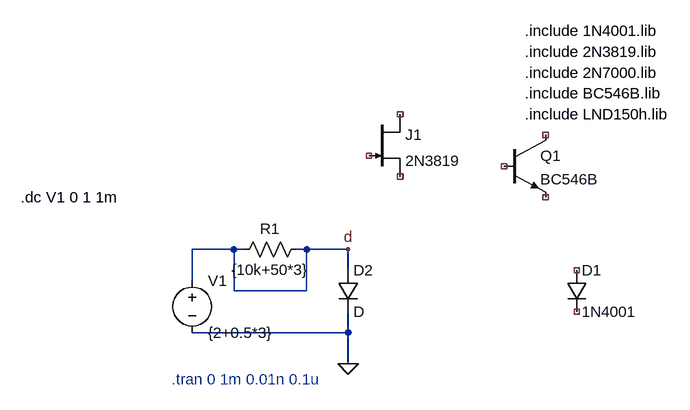
[diagram p0: schematic TP_FE diodo.asc]
TP_FE diodo.asc, the LTspice schematic file:
Version 4.1
SHEET 1 880 680
WIRE -144 432 -208 432
WIRE -128 432 -144 432
WIRE -32 432 -48 432
WIRE 32 432 -32 432
WIRE 32 464 32 432
WIRE -208 480 -208 432
WIRE -144 496 -144 432
WIRE -32 496 -32 432
WIRE -32 496 -144 496
WIRE 32 560 32 528
WIRE 32 560 -208 560
WIRE 32 608 32 560
FLAG 32 608 0
FLAG 32 432 d
SYMBOL diode 368 464 R0
SYMATTR InstName D1
SYMATTR Value 1N4001
SYMBOL njf 64 224 R0
SYMATTR InstName J1
SYMATTR Value 2N3819
SYMBOL npn 272 256 R0
SYMATTR InstName Q1
SYMATTR Value BC546B
SYMBOL voltage -208 464 R0
SYMATTR InstName V1
SYMATTR Value {2+0.5*3}
SYMBOL res -32 416 R90
WINDOW 0 0 56 VBottom 2
WINDOW 3 32 56 VTop 2
SYMATTR InstName R1
SYMATTR Value {10k+50*3}
SYMBOL diode 16 464 R0
SYMATTR InstName D2
TEXT 304 96 Left 2 !.include 1N4001.lib
TEXT 304 128 Left 2 !.include 2N3819.lib
TEXT 304 160 Left 2 !.include 2N7000.lib
TEXT 304 192 Left 2 !.include BC546B.lib
TEXT 304 224 Left 2 !.include LND150h.lib
TEXT -240 632 Left 2 ;.tran 0 1m 0.01n 0.1u
TEXT -472 352 Left 2 !.dc V1 0 1 1m

The netlist it stands for:
* TP_FE diodo.asc
D1 NC_01 NC_02 1N4001
J1 NC_03 NC_04 NC_05 2N3819
Q1 NC_06 NC_07 NC_08 0 BC546B
V1 d 0 {2+0.5*3}
R1 d d {10k+50*3}
D2 d 0 D
.model D D
.lib standard.dio
.model NPN NPN
.model PNP PNP
.lib standard.bjt
.model NJF NJF
.model PJF PJF
.lib standard.jft
.include 1N4001.lib
.include 2N3819.lib
.include 2N7000.lib
.include BC546B.lib
.include LND150h.lib
* .tran 0 1m 0.01n 0.1u
.dc V1 0 1 1m
.backanno
.end